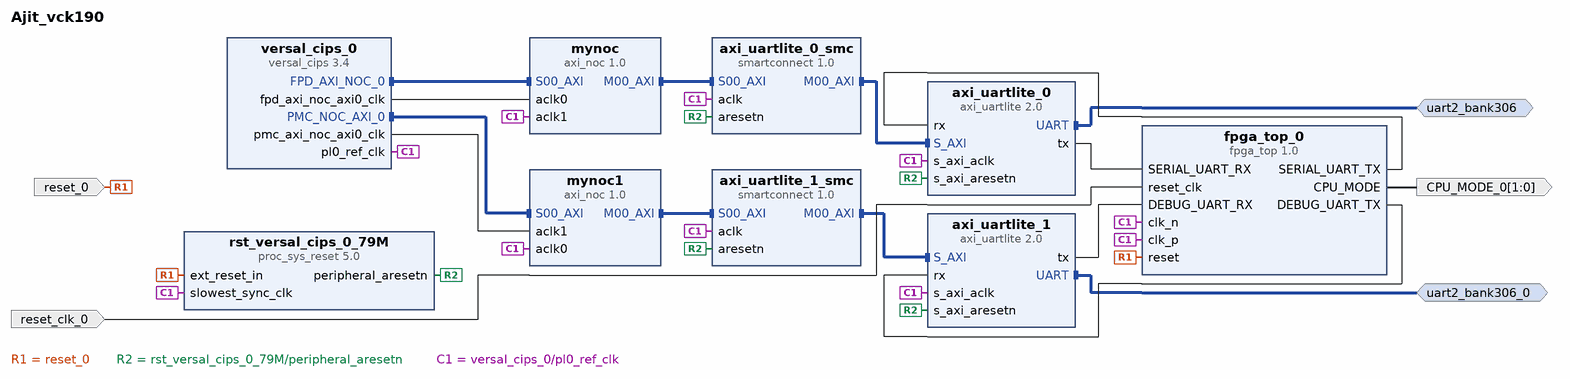
[diagram p0: block diagram of the top level]
# Vivado block design Ajit_vck190, xcvc1902-vsva2197-2MP-e-S, Vivado 2023.2
create_bd_design Ajit_vck190

create_bd_intf_port -mode Master -vlnv xilinx.com:interface:uart_rtl:1.0 uart2_bank306
create_bd_intf_port -mode Master -vlnv xilinx.com:interface:uart_rtl:1.0 uart2_bank306_0
create_bd_port -dir I -type rst reset_0
create_bd_port -dir I -type rst reset_clk_0
create_bd_port -dir O -from 1 -to 0 CPU_MODE_0

create_bd_cell -type ip -vlnv NinePath:NY:fpga_top:1.0 fpga_top_0
create_bd_cell -type ip -vlnv xilinx.com:ip:axi_uartlite:2.0 axi_uartlite_0
set_property -dict {CONFIG.UARTLITE_BOARD_INTERFACE uart2_bank306 CONFIG.USE_BOARD_FLOW true} [get_bd_cells axi_uartlite_0]
create_bd_cell -type ip -vlnv xilinx.com:ip:axi_uartlite:2.0 axi_uartlite_1
set_property -dict [list \
  CONFIG.C_BAUDRATE 115200 \
  CONFIG.UARTLITE_BOARD_INTERFACE Custom \
  CONFIG.USE_BOARD_FLOW true \
] [get_bd_cells axi_uartlite_1]
create_bd_cell -type ip -vlnv xilinx.com:ip:versal_cips:3.4 versal_cips_0
set_property -dict [list \
  CONFIG.CLOCK_MODE Custom \
  CONFIG.DDR_MEMORY_MODE Custom \
  CONFIG.IO_CONFIG_MODE Custom \
  CONFIG.PS_PMC_CONFIG {['CLOCK_MODE Custom', 'DDR_MEMORY_MODE Custom', 'IO_CONFIG_MODE Custom', 'PMC_CRP_PL0_REF_CTRL_FREQMHZ 100', 'PMC_USE_PMC_NOC_AXI0 1', 'PS_UART0_PERIPHERAL {{ENABLE 1} {IO {PS_MIO 0 .. 1}}}', 'PS_UART1_PERIPHERAL {{ENABLE 1} {IO {PMC_MIO 4 .. 5}}}', 'PS_USE_FPD_AXI_NOC0 1', 'PS_USE_PMCPL_CLK0 1', 'SMON_ALARMS Set_Alarms_On', 'SMON_ENABLE_TEMP_AVERAGING 0', 'SMON_TEMP_AVERAGING_SAMPLES 0']} \
] [get_bd_cells versal_cips_0]
create_bd_cell -type ip -vlnv xilinx.com:ip:proc_sys_reset:5.0 rst_versal_cips_0_79M
create_bd_cell -type ip -vlnv xilinx.com:ip:axi_noc:1.0 mynoc
set_property -dict {CONFIG.NUM_CLKS 2 CONFIG.NUM_MI 1} [get_bd_cells mynoc]
create_bd_cell -type ip -vlnv xilinx.com:ip:smartconnect:1.0 axi_uartlite_0_smc
set_property -dict {CONFIG.NUM_MI 1 CONFIG.NUM_SI 1} [get_bd_cells axi_uartlite_0_smc]
create_bd_cell -type ip -vlnv xilinx.com:ip:smartconnect:1.0 axi_uartlite_1_smc
set_property -dict {CONFIG.NUM_MI 1 CONFIG.NUM_SI 1} [get_bd_cells axi_uartlite_1_smc]
create_bd_cell -type ip -vlnv xilinx.com:ip:axi_noc:1.0 mynoc1
set_property -dict {CONFIG.NUM_CLKS 2 CONFIG.NUM_MI 1} [get_bd_cells mynoc1]

# ---- connections ----

connect_bd_intf_net [get_bd_intf_ports uart2_bank306] [get_bd_intf_pins axi_uartlite_0/UART]
connect_bd_intf_net [get_bd_intf_pins axi_uartlite_0/S_AXI] [get_bd_intf_pins axi_uartlite_0_smc/M00_AXI]
connect_bd_intf_net [get_bd_intf_ports uart2_bank306_0] [get_bd_intf_pins axi_uartlite_1/UART]
connect_bd_intf_net [get_bd_intf_pins axi_uartlite_1/S_AXI] [get_bd_intf_pins axi_uartlite_1_smc/M00_AXI]
connect_bd_intf_net [get_bd_intf_pins mynoc1/M00_AXI] [get_bd_intf_pins axi_uartlite_1_smc/S00_AXI]
connect_bd_intf_net [get_bd_intf_pins axi_uartlite_0_smc/S00_AXI] [get_bd_intf_pins mynoc/M00_AXI]
connect_bd_intf_net [get_bd_intf_pins versal_cips_0/FPD_AXI_NOC_0] [get_bd_intf_pins mynoc/S00_AXI]
connect_bd_intf_net [get_bd_intf_pins versal_cips_0/PMC_NOC_AXI_0] [get_bd_intf_pins mynoc1/S00_AXI]
connect_bd_net [get_bd_pins axi_uartlite_0/tx] [get_bd_pins fpga_top_0/SERIAL_UART_RX]
connect_bd_net [get_bd_pins axi_uartlite_1/tx] [get_bd_pins fpga_top_0/DEBUG_UART_RX]
connect_bd_net [get_bd_pins fpga_top_0/CPU_MODE] [get_bd_ports CPU_MODE_0]
connect_bd_net [get_bd_pins fpga_top_0/DEBUG_UART_TX] [get_bd_pins axi_uartlite_1/rx]
connect_bd_net [get_bd_pins fpga_top_0/SERIAL_UART_TX] [get_bd_pins axi_uartlite_0/rx]
connect_bd_net -net reset_0_1 [get_bd_ports reset_0] [get_bd_pins fpga_top_0/reset] [get_bd_pins rst_versal_cips_0_79M/ext_reset_in]
connect_bd_net -net reset_clk_0_1 [get_bd_ports reset_clk_0] [get_bd_pins fpga_top_0/reset_clk]
connect_bd_net [get_bd_pins rst_versal_cips_0_79M/peripheral_aresetn] \
  [get_bd_pins axi_uartlite_0/s_axi_aresetn] [get_bd_pins axi_uartlite_1/s_axi_aresetn] \
  [get_bd_pins axi_uartlite_0_smc/aresetn] [get_bd_pins axi_uartlite_1_smc/aresetn]
connect_bd_net [get_bd_pins versal_cips_0/fpd_axi_noc_axi0_clk] [get_bd_pins mynoc/aclk0]
connect_bd_net [get_bd_pins versal_cips_0/pl0_ref_clk] \
  [get_bd_pins axi_uartlite_0/s_axi_aclk] [get_bd_pins axi_uartlite_1/s_axi_aclk] [get_bd_pins fpga_top_0/clk_n] \
  [get_bd_pins fpga_top_0/clk_p] [get_bd_pins rst_versal_cips_0_79M/slowest_sync_clk] [get_bd_pins mynoc/aclk1] \
  [get_bd_pins axi_uartlite_0_smc/aclk] [get_bd_pins axi_uartlite_1_smc/aclk] [get_bd_pins mynoc1/aclk0]
connect_bd_net [get_bd_pins versal_cips_0/pmc_axi_noc_axi0_clk] [get_bd_pins mynoc1/aclk1]

# ---- address map ----
assign_bd_address -offset 0x0000020140000000 -range 64K -target_address_space [get_bd_addr_spaces versal_cips_0/FPD_AXI_NOC_0] [get_bd_addr_segs axi_uartlite_0/S_AXI/Reg]
assign_bd_address -offset 0x0000020100000000 -range 64K -target_address_space [get_bd_addr_spaces versal_cips_0/PMC_NOC_AXI_0] [get_bd_addr_segs axi_uartlite_1/S_AXI/Reg]

validate_bd_design
save_bd_design
